# EAGLE design mss-centipede (EAGLE 5.11)
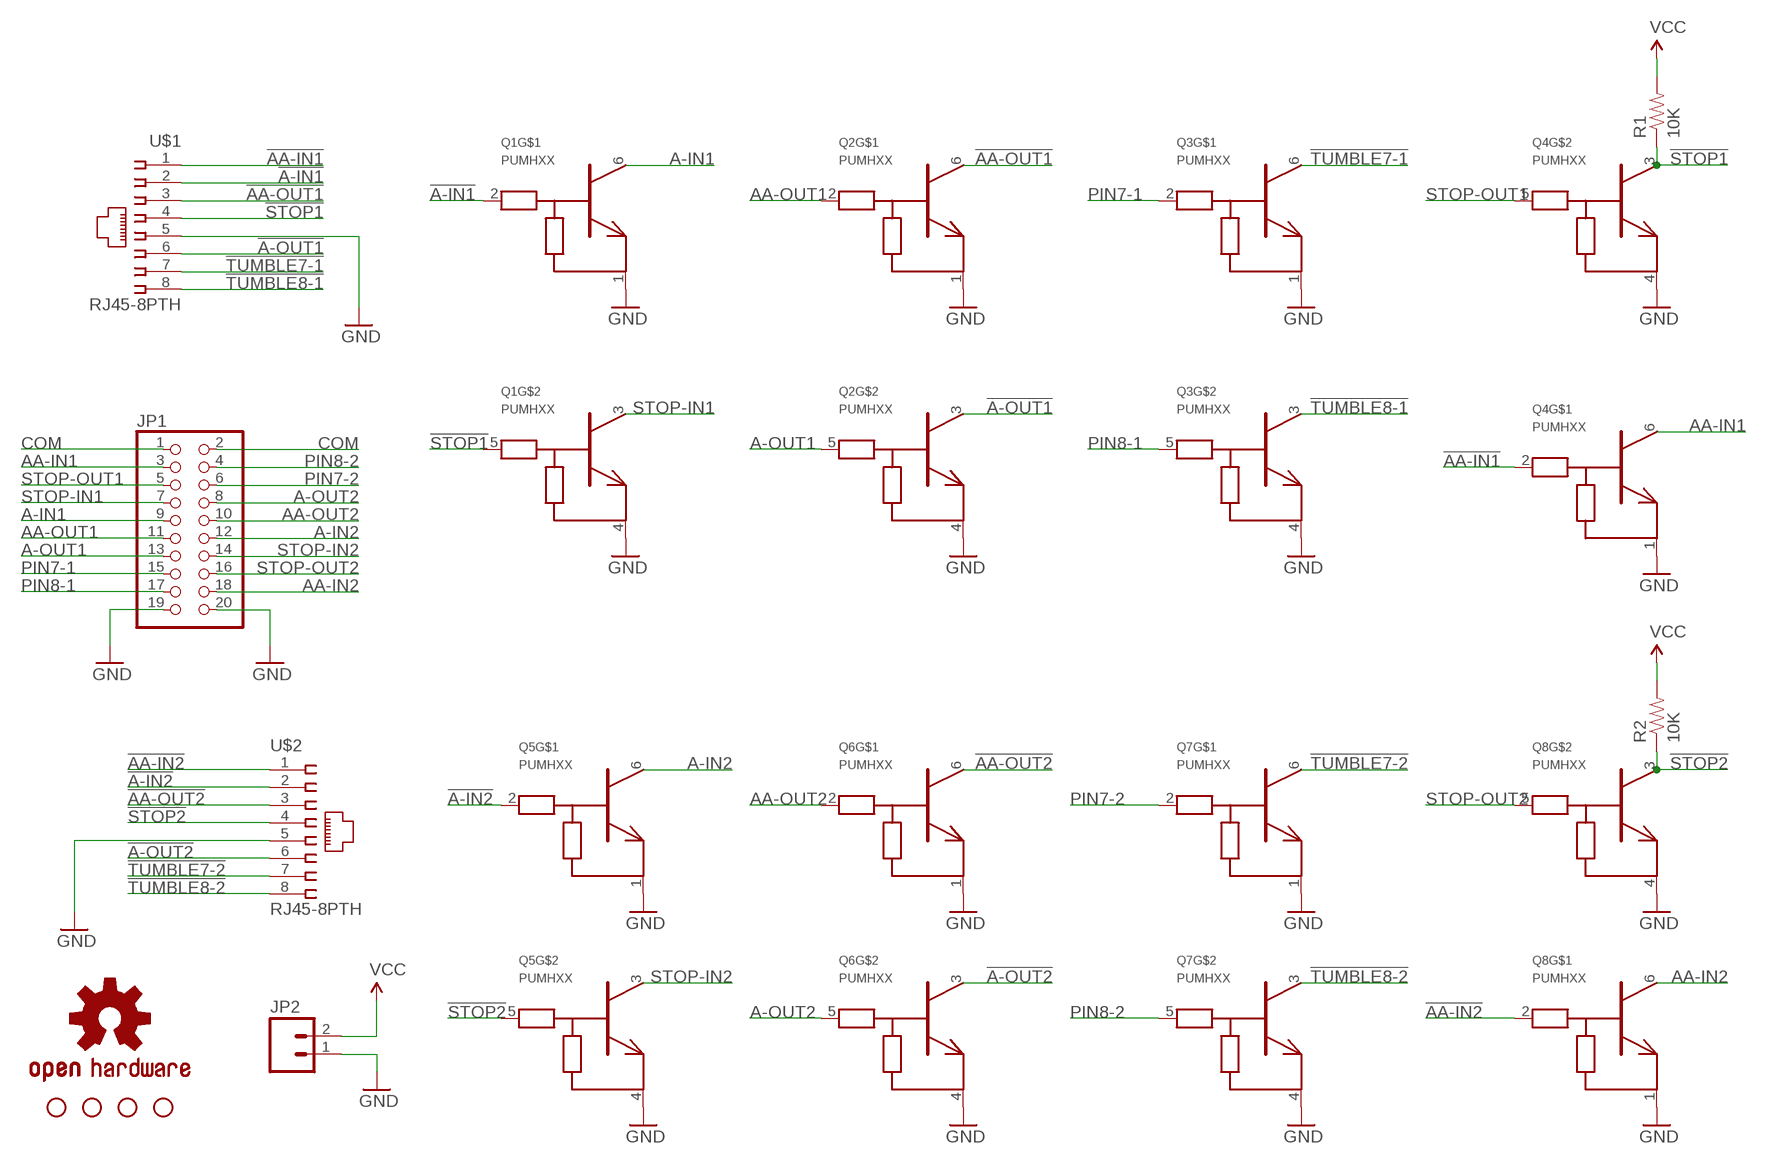
[diagram p0: schematic, sheet 1]

## Parts
JP1  PINHD-2X10  [2X10]
JP2  M023.5MM  [SCREWTERMINAL-3.5MM-2]
JP5  STAND-OFF  [STAND-OFF]
JP6  STAND-OFF  [STAND-OFF]
JP7  STAND-OFF  [STAND-OFF]
JP8  STAND-OFF  [STAND-OFF]
OHW  OSHW-LOGOM  [OSHW-LOGO-M]
Q1  PUMHXX  [SOT363]
Q2  PUMHXX  [SOT363]
Q3  PUMHXX  [SOT363]
Q4  PUMHXX  [SOT363]
Q5  PUMHXX  [SOT363]
Q6  PUMHXX  [SOT363]
Q7  PUMHXX  [SOT363]
Q8  PUMHXX  [SOT363]
R1  10K  RESISTOR0805-RES  [0805]
R2  10K  RESISTOR0805-RES  [0805]
U$1  RJ45-8PTH  215877-4  [215877-4]
U$2  RJ45-8PTH  215877-4  [215877-4]

## Nets
!A-IN1: Q1.2(B) U$1.2
!A-IN2: Q5.2(B) U$2.2
!A-OUT1: Q2.3(C) U$1.6
!A-OUT2: Q6.3(C) U$2.6
!AA-IN1: Q4.2(B) U$1.1
!AA-IN2: Q8.2(B) U$2.1
!AA-OUT1: Q2.6(C) U$1.3
!AA-OUT2: Q6.6(C) U$2.3
!STOP1: Q1.5(B) Q4.3(C) R1.1 U$1.4
!STOP2: Q5.5(B) Q8.3(C) R2.1 U$2.4
!TUMBLE7-1: Q3.6(C) U$1.7
!TUMBLE7-2: Q7.6(C) U$2.7
!TUMBLE8-1: Q3.3(C) U$1.8
!TUMBLE8-2: Q7.3(C) U$2.8
A-IN1: JP1.9 Q1.6(C)
A-IN2: JP1.12 Q5.6(C)
A-OUT1: JP1.13 Q2.5(B)
A-OUT2: JP1.8 Q6.5(B)
AA-IN1: JP1.3 Q4.6(C)
AA-IN2: JP1.18 Q8.6(C)
AA-OUT1: JP1.11 Q2.2(B)
AA-OUT2: JP1.10 Q6.2(B)
COM: JP1.1 JP1.2
GND: JP1.19 JP1.20 JP2.1 Q1.1(E) Q1.4(E) Q2.1(E) Q2.4(E) Q3.1(E) Q3.4(E) Q4.1(E) Q4.4(E) Q5.1(E) Q5.4(E) Q6.1(E) Q6.4(E) Q7.1(E) Q7.4(E) Q8.1(E) Q8.4(E) U$1.5 U$2.5
PIN7-1: JP1.15 Q3.2(B)
PIN7-2: JP1.6 Q7.2(B)
PIN8-1: JP1.17 Q3.5(B)
PIN8-2: JP1.4 Q7.5(B)
STOP-IN1: JP1.7 Q1.3(C)
STOP-IN2: JP1.14 Q5.3(C)
STOP-OUT1: JP1.5 Q4.5(B)
STOP-OUT2: JP1.16 Q8.5(B)
VCC: JP2.2 R1.2 R2.2

## Library data of the parts
JP1 = pinhead:PINHD-2X10: PIN HEADER
JP2 = SparkFun:M02: Header 2 Standard 2-pin 0.1" header. Use with straight break away headers (SKU : PRT-00116), right angle break away headers (PRT-00553), swiss pins (PRT-00743), machine pins (PRT-00117), and female headers (PRT-00115). Molex polarized connector foot print use with SKU : PRT-08233 with associated crimp pins and housings.
JP5-JP8 = SparkFun:STAND-OFF: Stand Off This is the mechanical footprint for a #4 phillips button head screw. Use the keepout ring to avoid running the screw head into surrounding components. SKU : PRT-00447
OHW = SparkFun:OSHW-LOGO: Open Source Hardware Logo This logo indicates the piece of hardware it is found on incorporates a OSHW license and/or adheres to the definition of open source hardware found here: http://freedomdefined.org/OSHW
Q1-Q8 = nxp-ret:PUMHXX
R1 R2 = SparkFun:RESISTOR: Resistor Basic schematic elements and footprints for 0603, 1206, and PTH resistors.
U$1 U$2 = con-amp:215877-4: AMP connector; OC_FARNELL: unknown; OC_NEWARK: unknown

## Board
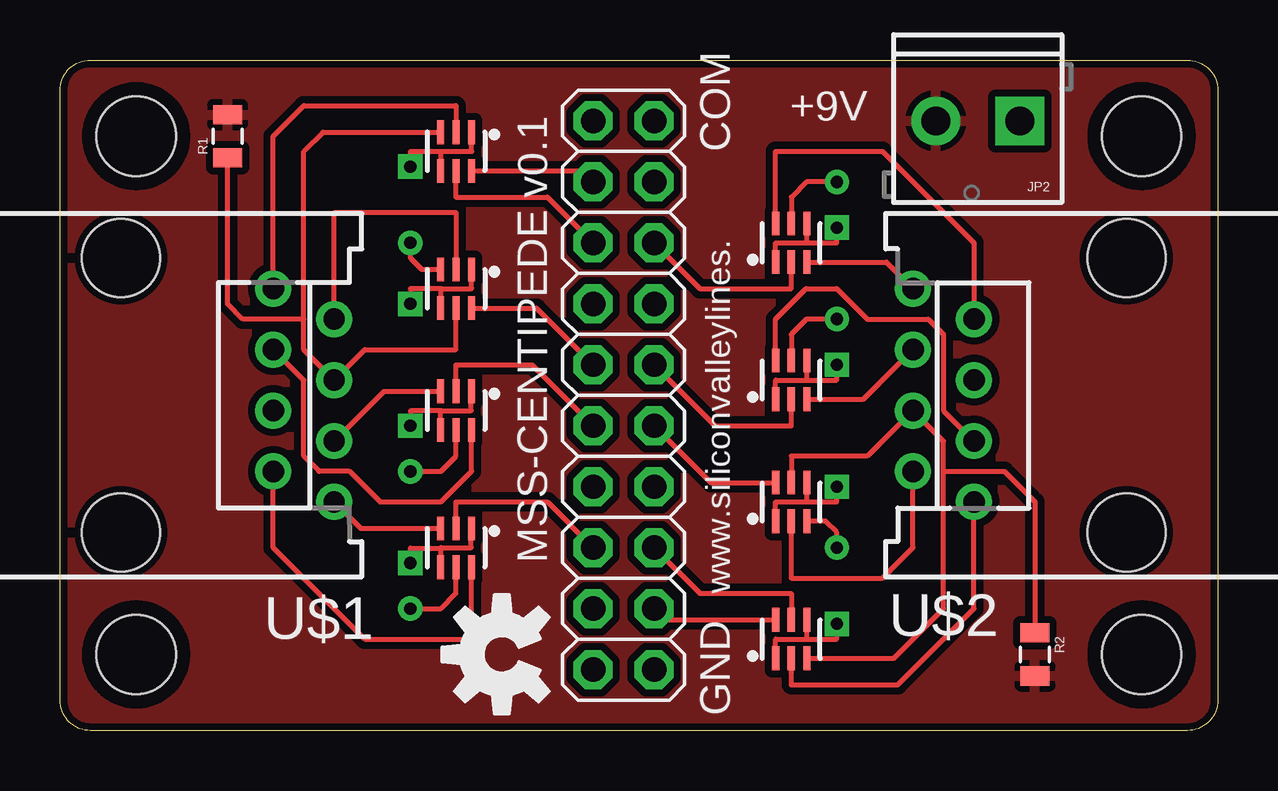
[diagram p1: board, top side]
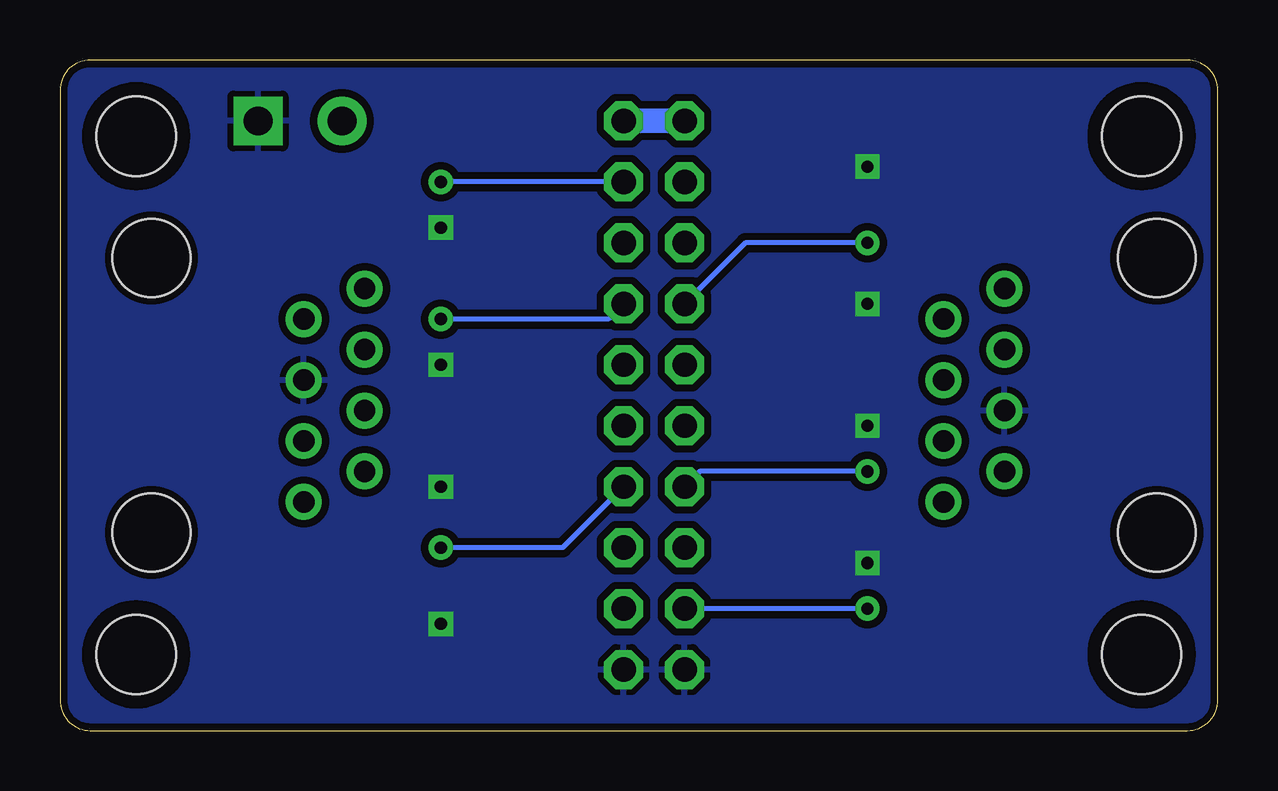
[diagram p2: board, bottom side, seen from below]

Size 48.26 x 27.94 mm. Coordinates in mm from the lower left corner, seen from the top.
Outline: 0,26.67 arc-90 1.27,27.94 46.99,27.94 arc-90 48.26,26.67 48.26,1.27 arc-90 46.99,0 1.27,0 arc-90 0,1.27 0,26.67
Copper layers (1*16): Top 0.035mm / dielectric 1.5mm / Bottom 0.035mm
Design rules "SparkFun": minimum track width 8mil, minimum drill 20mil, track to track 8mil, track to pad 8mil, pad to pad 8mil, via to via 8mil, smd to smd 8mil, copper to edge 10mil, drill to drill 8mil, minimum pad ring 12mil, minimum via ring 10mil, stop-mask expansion 4mil, vias tented up to drill 25mil, thermal gap 10mil

### Footprints (pad centres in the part's own frame; a part is rotated, then mirrored left to right if it is on the bottom)
2X10 = drill 1.016 octagon: 1 -11.43,-1.27; 2 -11.43,1.27; 3 -8.89,-1.27; 4 -8.89,1.27; 5 -6.35,-1.27; 6 -6.35,1.27; 7 -3.81,-1.27; 8 -3.81,1.27; 9 -1.27,-1.27; 10 -1.27,1.27; 11 1.27,-1.27; 12 1.27,1.27; 13 3.81,-1.27; 14 3.81,1.27; 15 6.35,-1.27; 16 6.35,1.27; 17 8.89,-1.27; 18 8.89,1.27; 19 11.43,-1.27; 20 11.43,1.27
SCREWTERMINAL-3.5MM-2 = drill 1.2 pad 2.032 square: 1 0,0 | drill 1.2 pad 2.032 round: 2 3.5,0
STAND-OFF = hole 3.302: 0,0
SOT363 = smd 0.3 x 0.99: 1 -0.65,-0.8; 2 0,-0.8; 3 0.65,-0.8; 4 0.65,0.81; 5 0,0.81; 6 -0.65,0.81
0805 = smd 0.8 x 1.2: 1 -0.9,0; 2 0.9,0
215877-4 = drill 0.889 round: 1 -4.445,6.35; 2 -3.175,8.89; 3 -1.905,6.35; 4 -0.635,8.89; 5 0.635,6.35; 6 1.905,8.89; 7 3.175,6.35; 8 4.445,8.89 | hole 3.251: -5.715,0; 5.715,0

### Placement (x,y rotation side)
JP1  23.5,13.97 270 top
JP2  40.01,25.4 180 top
JP5  45.09,3.17 90 top
JP6  3.17,3.17 90 top
JP7  3.17,24.77 90 top
JP8  45.09,24.77 0 top
OHW  18.41,3.17 90 top
Q1  16.51,18.41 180 top
Q2  16.51,13.34 180 top
Q3  16.51,7.62 180 top
Q4  16.51,24.13 180 top
Q5  30.48,9.53 0 top
Q6  30.48,14.61 0 top
Q7  30.48,20.32 0 top
Q8  30.48,3.81 0 top
R1  6.99,24.77 90 top
R2  40.64,3.17 270 top
U$1  2.54,13.97 270 top
U$2  44.45,13.97 90 top

### Tracks (layer width: path | path; a pad name or v marks a point on that pad's centre or on a via)
!A-IN1
  Top 0.203: Q1.2 16.51,21.59 11.43,21.59 U$1.2
!A-IN2
  Top 0.203: Q5.2 30.48,6.35 34.29,6.35 35.56,7.62 U$2.2
!A-OUT1
  Top 0.203: Q2.3 13.5,14.13 U$1.6
!A-OUT2
  Top 0.203: Q6.3 33.49,13.8 U$2.6
!AA-IN1
  Top 0.203: Q4.2 16.51,26.04 10.16,26.04 8.89,24.77 U$1.1
!AA-IN2
  Top 0.203: Q8.2 30.48,1.91 34.92,1.91 38.1,5.08 U$2.1
!AA-OUT1
  Top 0.203: Q2.6 17.16,10.81 15.88,9.53 13.34,9.53 12.06,10.79 10.79,10.79 10.16,11.43 10.16,14.61 U$1.3
!AA-OUT2
  Top 0.203: Q6.6 29.83,17.14 31.1,18.41 32.38,18.41 33.66,17.14 36.2,17.14 36.83,16.51 36.83,13.34 U$2.3
!STOP1
  Top 0.203: Q1.5 16.51,15.88 12.7,15.88 U$1.4 10.16,15.88 10.16,17.14 | Q4.3 10.96,24.93 10.16,24.13 10.16,17.14 | R1.1 6.99,17.78 7.62,17.14 10.16,17.14
!STOP2
  Top 0.203: Q5.5 30.48,11.43 33.66,11.43 U$2.4 36.83,12.06 36.83,10.79 | 36.83,10.79 36.83,5.08 34.76,3.01 Q8.3 | R2.1 40.64,9.53 39.37,10.79 36.83,10.79
!TUMBLE7-1
  Top 0.203: Q3.6 17.16,3.81 12.7,3.81 8.89,7.62 U$1.7
!TUMBLE7-2
  Top 0.203: Q7.6 29.83,24.13 34.29,24.13 38.1,20.32 U$2.7
!TUMBLE8-1
  Top 0.203: Q3.3 12.54,8.42 U$1.8
!TUMBLE8-2
  Top 0.203: Q7.3 34.45,19.52 U$2.8
A-IN1
  Top 0.203: Q1.6 19.86,17.61 JP1.9
A-IN2
  Top 0.203: JP1.12 27.13,10.34 Q5.6
A-OUT1  (via drill 0.51)
  Top 0.203: Q2.5 16.51,11.43 15.88,10.79 v14.61,10.79
  Bottom 0.203: v14.61,10.79 21.59,10.79 JP1.13
A-OUT2  (via drill 0.51)
  Top 0.203: Q6.5 30.48,16.51 31.11,17.14 v32.38,17.14
  Bottom 0.203: v32.38,17.14 25.4,17.14 JP1.8
AA-IN1
  Top 0.203: Q4.6 21.77,23.32 JP1.3
AA-IN2
  Top 0.203: Q8.6 25.23,4.62 JP1.18
AA-OUT1
  Top 0.203: Q2.2 16.51,15.24 19.68,15.24 JP1.11
AA-OUT2
  Top 0.203: Q6.2 30.48,12.7 27.3,12.7 JP1.10
COM
  Bottom 1.016: JP1.1 JP1.2
GND  (via drill 0.51)
  Top 0.203: Q2.4 15.86,13.32 | 15.86,13.32 15.88,13.34 17.14,13.34 17.14,14.12 Q2.1 | Q1.1 17.16,18.43 17.14,18.41 15.88,18.41 | 15.88,18.41 15.88,17.62 Q1.4 | 15.86,7.61 15.88,7.62 17.14,7.62 17.14,8.4 Q3.1 | 15.86,7.61 Q3.4 | 31.13,9.53 Q5.4 | Q5.1 29.83,9.53 31.13,9.53 | Q6.1 29.83,14.61 31.13,14.61 | Q7.1 29.83,20.32 31.13,20.32 | 31.13,14.61 Q6.4 | 31.13,20.32 Q7.4 | Q4.1 17.16,24.13 15.86,24.13 | 15.86,24.13 Q4.4 | Q8.1 29.83,3.81 31.13,3.81 | 31.13,3.81 Q8.4 | v14.61,17.78 14.61,18.41 15.88,18.41 | v14.61,12.7 14.61,13.32 15.86,13.32 | v14.61,23.5 14.61,24.13 15.86,24.13 | v14.61,6.99 14.61,7.61 15.86,7.61 | v32.38,15.24 32.38,14.61 31.13,14.61 | v32.38,20.95 32.38,20.32 31.13,20.32 | v32.38,10.16 32.38,9.53 31.13,9.53 | v32.38,4.45 32.38,3.81 31.13,3.81
  pour Bottom (isolate 0.305): 48.26,0 0,0 0,27.94 48.26,27.94
PIN7-1
  Top 0.203: Q3.2 16.51,9.53 20.32,9.53 JP1.15
PIN7-2
  Top 0.203: Q7.2 30.48,18.41 26.67,18.41 JP1.6
PIN8-1  (via drill 0.51)
  Top 0.203: Q3.5 16.51,5.71 15.88,5.08 v14.61,5.08
  Bottom 0.203: v14.61,5.08 JP1.17
PIN8-2  (via drill 0.51)
  Top 0.203: Q7.5 30.48,22.23 31.11,22.86 v32.38,22.86
  Bottom 0.203: JP1.4 v32.38,22.86
STOP-IN1  (via drill 0.51)
  Top 0.203: v14.61,20.32 14.61,19.68 15.07,19.21 Q1.3
  Bottom 0.203: v14.61,20.32 19.68,20.32 JP1.7
STOP-IN2  (via drill 0.51)
  Top 0.203: v32.38,7.62 32.38,8.26 31.91,8.72 Q5.3
  Bottom 0.203: v32.38,7.62 27.3,7.62 JP1.14
STOP-OUT1
  Top 0.203: Q4.5 16.51,22.23 20.32,22.23 JP1.5
STOP-OUT2
  Top 0.203: Q8.5 30.48,5.71 26.67,5.71 JP1.16
VCC
  pour Top (isolate 0.305): 48.26,0 0,0 0,27.94 48.26,27.94

### Text on the board
tPlace: +9V | COM | MSS-CENTIPEDE v0.1 | www.siliconvalleylines. | GND